# Altium schematic sheet Avcilar_Kartli_Gecis_Sistemi.SchDoc
size A4; SheetNumber: 1; SheetTotal: 1
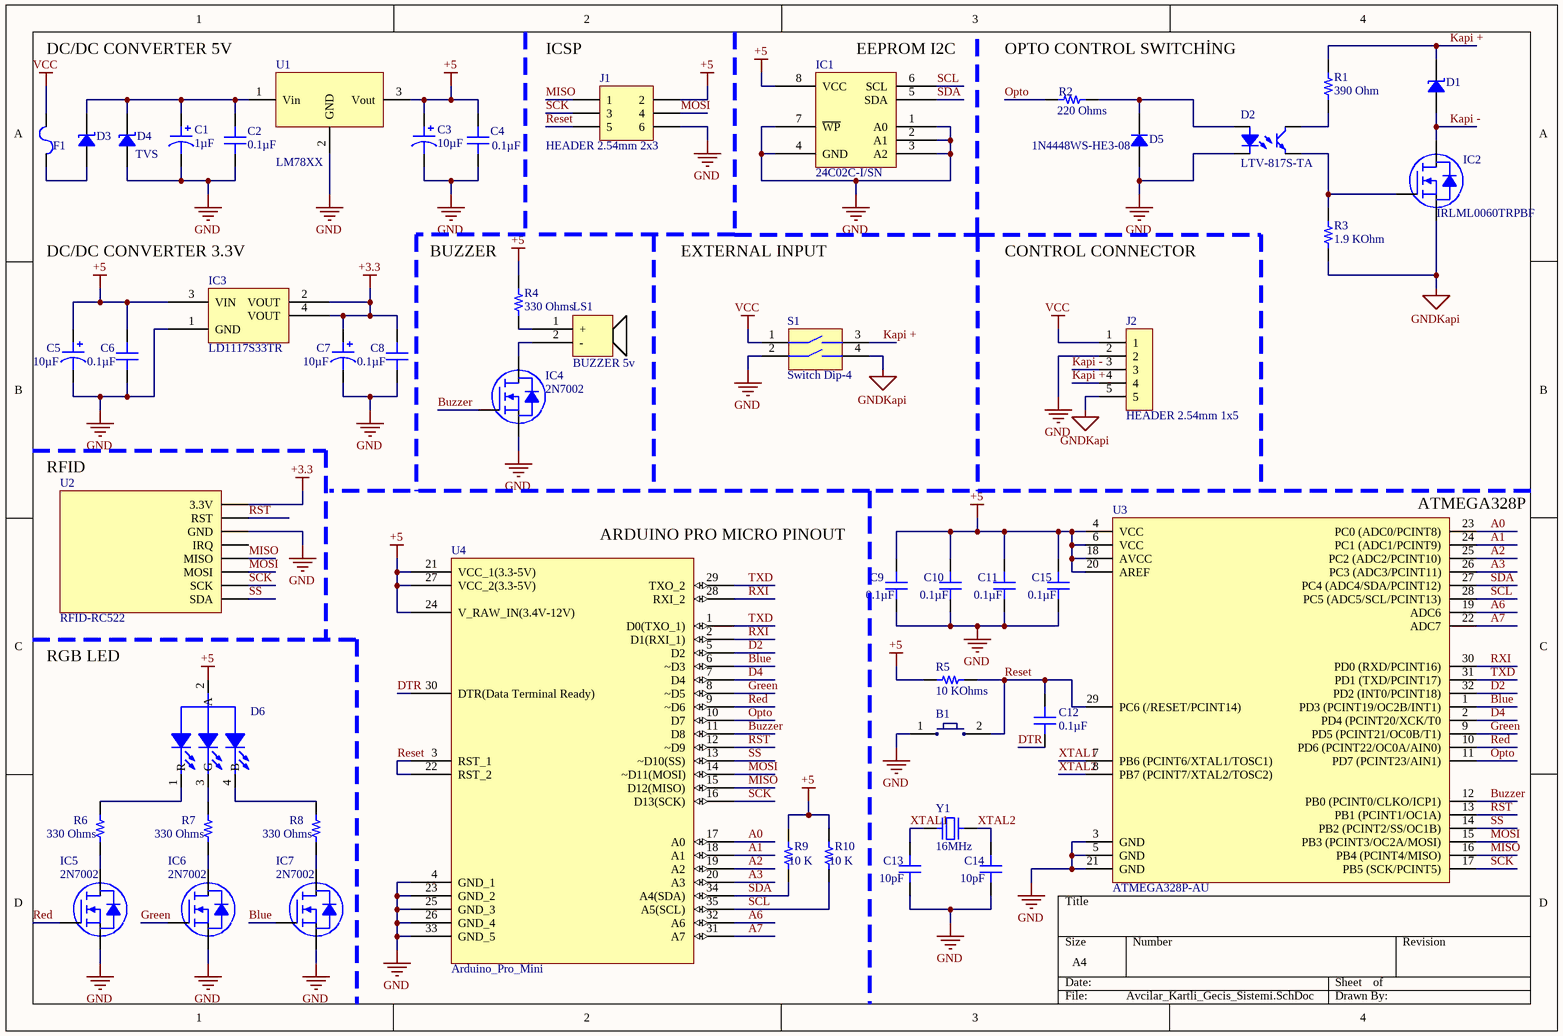
[diagram p0: Avcilar_Kartli_Gecis_Sistemi.SchDoc]

## Parts
B1  Push Button Tact  [PUSB BUTTON-SMD TACT]  (value not drawn)
C1  1µF  [CAP ALSMD POLY 4.3MM H5.5MM]
C2  0.1µF  [CAP 1206_3216 - 1.8MM]
C3  10µF  [CAP POL 1206_3216]
C4  0.1µF  [CAP 1206_3216 - 1.0MM]
C5  10µF  [CAP POL 1206_3216]
C6  0.1µF  [CAP 1206_3216 - 1.0MM]
C7  10µF  [CAP POL 1206_3216]
C8  0.1µF  [CAP 1206_3216 - 1.0MM]
C9  0.1µF  [CAP 1206_3216 - 1.0MM]
C10  0.1µF  [CAP 1206_3216 - 1.0MM]
C11  0.1µF  [CAP 1206_3216 - 1.0MM]
C12  0.1µF  [CAP 1206_3216 - 1.0MM]
C13  10pF  [CAP 1206_3216 - 1.0MM]
C14  10pF  [CAP 1206_3216 - 1.0MM]
C15  0.1µF  [CAP 1206_3216 - 1.0MM]
D1  S2G_R3_00001  [DO214AB SMC]  (value not drawn)
D2  LTV-817S-TA  [DIP-4]
D3  S2G_R3_00001  [DO214AB SMC]  (value not drawn)
D4  TVS  [DO214AC SMA]
D5  1N4448WS-HE3-08  [SOD323]
D6  RGB LED  [RGB LED]  (value not drawn)
F1  3413.0219.22  [FUSE 1206_3216 0.6MM]  (value not drawn)
IC1  24C02C-I/SN  [MICROCHIP SOIC-8 150MIL WIDE]
IC2  IRLML0060TRPBF  [INFINEON SOT-23-3]
IC3  LD1117S33TR  [ST SOT-223]
IC4  2N7002  [ON SEMI SOT-23-3]
IC5  2N7002  [ON SEMI SOT-23-3]
IC6  2N7002  [ON SEMI SOT-23-3]
IC7  2N7002  [ON SEMI SOT-23-3]
J1  HEADER 2.54mm 2x3  [HEADER 2.54mm 2x3]
J2  HEADER 2.54mm 1x5  [HEADER 2.54mm 1x5]
LS1  BUZZER 5v  [BUZZER 5v]
R1  390 Ohm  [RES 1206_3216]
R2  220 Ohms  [RES 1206_3216]
R3  1.9 KOhm  [RES 1206_3216]
R4  330 Ohms  [RES 1206_3216]
R5  10 KOhms  [RES 1206_3216]
R6  330 Ohms  [RES 1206_3216]
R7  330 Ohms  [RES 1206_3216]
R8  330 Ohms  [RES 1206_3216]
R9  10 K  [RES 1206_3216]
R10  10 K  [RES 1206_3216]
S1  Switch Dip-4  [DIP-4 - SWITCH]
U1  LM78XX  [D2PAK-3 (TO263-3)]
U2  RFID-RC522  [RFID-RC522]
U3  ATMEGA328P-AU  [TQFP80P900X900X120-32N]
U4  Arduino_Pro_Mini  [Arduino_Pro_Mini]
Y1  16MHz  [TXC 9C]

## Nets
+3.3: C7.1 C8.2 IC3.2(VOUT) IC3.4(VOUT) U2.1(3.3V)
+5: C3.1 C4.2 C5.1 C6.2 C9.2 C10.2 C11.2 C15.2 D6.2(A) IC1.8(VCC) IC3.3(VIN) J1.2 R4.2 R5.1 R9.1 R10.1 U1.3(Vout) U3.4(VCC) U3.6(VCC) U3.18(AVCC) U3.20(AREF) U4.21(VCC_1(3.3-5V)) U4.24(V_RAW_IN(3.4V-12V)) U4.27(VCC_2(3.3-5V))
GND: B1.1 C1.2 C2.1 C3.2 C4.1 C5.2 C6.1 C7.2 C8.1 C9.1 C10.1 C11.1 C13.1 C14.1 C15.1 D2.2 D4.1 D5.1 IC1.1(A0) IC1.2(A1) IC1.3(A2) IC1.4(GND) IC1.7(~{WP}) IC3.1(GND) IC4.2(S) IC5.2(S) IC6.2(S) IC7.2(S) J1.6 J2.2 S1.2 U1.2(GND) U2.3(GND) U3.3(GND) U3.5(GND) U3.21(GND) U4.4(GND_1) U4.23(GND_2) U4.25(GND_3) U4.26(GND_4) U4.33(GND_5)
GNDKapi: IC2.2(S) J2.5 R3.1 S1.4
VCC: F1.2 J2.1 S1.1
A0: U3.23(PC0_(ADC0/PCINT8)) U4.17(A0)
A1: U3.24(PC1_(ADC1/PCINT9)) U4.18(A1)
A2: U3.25(PC2_(ADC2/PCINT10)) U4.19(A2)
A3: U3.26(PC3_(ADC3/PCINT11)) U4.20(A3)
A6: U3.19(ADC6) U4.32(A6)
A7: U3.22(ADC7) U4.31(A7)
Blue: IC7.1(G) U3.1(PD3_(PCINT19/OC2B/INT1)) U4.6(~D3)
Buzzer: IC4.1(G) U3.12(PB0_(PCINT0/CLKO/ICP1)) U4.11(D8)
D2: U3.32(PD2_(INT0/PCINT18)) U4.5(D2)
D4: U3.2(PD4_(PCINT20/XCK/T0) U4.7(D4)
DTR: C12.1 U4.30(DTR(Data_Terminal_Ready))
Green: IC6.1(G) U3.9(PD5_(PCINT21/OC0B/T1)) U4.8(~D5)
Kapi +: D1.2 J2.4 R1.2 S1.3
Kapi -: D1.1 IC2.3(D) J2.3
MISO: J1.1 U2.5(MISO) U3.16(PB4_(PCINT4/MISO)) U4.15(D12(MISO))
MOSI: J1.4 U2.6(MOSI) U3.15(PB3_(PCINT3/OC2A/MOSI)) U4.14(~D11(MOSI))
Opto: R2.2 U3.11(PD7_(PCINT23/AIN1)) U4.10(D7)
Red: IC5.1(G) U3.10(PD6_(PCINT22/OC0A/AIN0)) U4.9(~D6)
Reset: B1.2 C12.2 J1.5 R5.2 U3.29(PC6_(/RESET/PCINT14)) U4.3(RST_1) U4.22(RST_2)
RST: U2.2(RST) U3.13(PB1_(PCINT1/OC1A)) U4.12(~D9)
RXI: U3.30(PD0_(RXD/PCINT16)) U4.2(D1(RXI_1)) U4.28(RXI_2)
SCK: J1.3 U2.7(SCK) U3.17(PB5_(SCK/PCINT5)) U4.16(D13(SCK))
SCL: IC1.6(SCL) R10.2 U3.28(PC5_(ADC5/SCL/PCINT13)) U4.35(A5(SCL))
SDA: IC1.5(SDA) R9.2 U3.27(PC4_(ADC4/SDA/PCINT12)) U4.34(A4(SDA))
SS: U2.8(SDA) U3.14(PB2_(PCINT2/SS/OC1B)) U4.13(~D10(SS))
TXD: U3.31(PD1_(TXD/PCINT17)) U4.1(D0(TXO_1)) U4.29(TXO_2)
XTAL1: C13.2 U3.7(PB6_(PCINT6/XTAL1/TOSC1)) Y1.1
XTAL2: C14.2 U3.8(PB7_(PCINT7/XTAL2/TOSC2)) Y1.2
NetC1_1: C1.1 C2.2 D3.2 D4.2 U1.1(Vin)
NetD2_1: D2.1 D5.2 R2.1
NetD2_3: D2.3 IC2.1(G) R3.2
NetD2_4: D2.4 R1.1
NetD3_1: D3.1 F1.1
NetD6_1: D6.1(R) R6.2
NetD6_3: D6.3(G) R7.2
NetD6_4: D6.4(B) R8.2
NetIC4_3: IC4.3(D) LS1.2(-)
NetIC5_3: IC5.3(D) R6.1
NetIC6_3: IC6.3(D) R7.1
NetIC7_3: IC7.3(D) R8.1
NetLS1_1: LS1.1(+) R4.1

Not connected (* = marked no-connect by the designer): U2 4(IRQ)

## Notes on the sheet
- DC/DC CONVERTER 5V
- (near J1) ICSP
- (near IC1) EEPROM I2C
- (near R2) OPTO CONTROL SWITCHİNG
- (near IC3) DC/DC CONVERTER 3.3V
- (near R4) BUZZER
- EXTERNAL INPUT
- CONTROL CONNECTOR
- RFID
- (near U3) ATMEGA328P
- (near U4) ARDUINO PRO MICRO PINOUT
- RGB LED

## Library data of the parts
B1 = Push Button Tact: Smd Push Button Tact Mini Tip; Satın Alma Linki: https://urun.n11.com/diger/mini-pushbutton-switch-smd-P227461537?gclid=Cj0KCQjwkoDmBRCcARIsAG3xzl8Y_-jeD7HocNM6lvuZ_rVp83568XPGtNzlPwXWLph8oCRqo0yh87UaApZYEALw_wcB&gclsrc=aw.ds
C1 = 50SEV1M4X5.5: CAP ALUM 1UF 20% 50V SMD; Manufacturer: Rubycon; Lifetime @ Temp.: 2000 Hrs @ 85°C; Polarization: Polar; Ripple Current @ High Frequency: 12.6mA @ 10kHz; Ripple Current @ Low Frequency: 8.4mA @ 120Hz; Surface Mount Land Size: 0.169" L x 0.169" W (4.30mm x 4.30mm); Part Number: 50SEV1M4X5.5; Applications: Automotive; Capacitance: 1µF; ComponentLink1Description: Datasheet; ComponentLink1URL: http://www.rubycon.co.jp/en/catalog/e_pdfs/aluminum/e_sev.pdf; ComponentLink2Description: DigiKey Link; ComponentLink2URL: http://digikey.com/product-detail/en/rubycon/50SEV1M4X5.5/1189-2464-1-ND/4842368; Device Package: Radial, Can - SMD; Height - Seated (Max): 0.217" (5.50mm); LastUpdated: 02/09/2020 01:23:45; Lifecycle Status: Active; Minimum Order: 1; Mounting Type: Surface Mount; Operating Temperature: -40°C ~ 85°C; Package / Case: Radial, Can - SMD; Packaging: TapeAndReel; PartId: 7344; Part Status: Active; Price: 0.10; Ratings: AEC-Q200; Series: SEV; Size / Dimension: 0.157" Dia (4.00mm); Supplier 1: DigiKey; Supplier Part Number 1: 1189-2464-1-ND; Tolerance: ±20%; Value: 1µF; Voltage - Rated: 50V
C2 = CC1206JKNPO9BN104: CAP CER 0.1UF 50V C0G/NP0 1206; Manufacturer: Yageo; Temperature Coefficient: C0G, NP0; Tolerance: ±5%; Part Number: CC1206JKNPO9BN104; Value: 0.1µF; Applications: General Purpose; Capacitance: 0.1µF; ComponentLink1Description: Datasheet; ComponentLink1URL: https://www.yageo.com/upload/media/product/productsearch/datasheet/mlcc/UPY-GP_NP0_16V-to-50V_17.pdf; ComponentLink2Description: DigiKey Link; ComponentLink2URL: http://digikey.com/product-detail/en/yageo/CC1206JKNPO9BN104/311-4621-1-ND/9645659; Device Package: 1206 (3216 Metric); LastUpdated: 02/09/2020 01:05:25; Lifecycle Status: Active; Minimum Order: 1; Mounting Type: Surface Mount, MLCC; Operating Temperature: -55°C ~ 125°C; Package / Case: 1206 (3216 Metric); Packaging: TapeAndReel; PartId: 22519; Part Status: Active; Price: 0.64; Series: CC; Size / Dimension: 0.126" L x 0.063" W (3.20mm x 1.60mm); Supplier 1: DigiKey; Supplier Part Number 1: 311-4621-1-ND; Thickness (Max): 0.071" (1.80mm); Voltage - Rated: 50V
C3 C5 C7 = 293D106X9016A2TE3: CAP TANT 10UF 10% 16V 1206 A Case; Manufacturer: Vishay Sprague; ESR (Equivalent Series Resistance): 3Ohm; Type: Molded; Part Number: 293D106X9016A2TE3; Value: 10µF; Capacitance: 10µF; ComponentLink1Description: Datasheet; ComponentLink1URL: http://www.vishay.com/docs/40002/293d.pdf; ComponentLink2Description: DigiKey Link; ComponentLink2URL: http://digikey.com/product-detail/en/vishay-sprague/293D106X9016A2TE3/718-1123-1-ND/1559617; Device Package: 1206 (3216 Metric); Features: General Purpose; Height - Seated (Max): 0.071" (1.80mm); LastUpdated: 02/09/2020 01:15:58; Lifecycle Status: Active; Manufacturer Size Code: A; Minimum Order: 1; Mounting Type: Surface Mount; Operating Temperature: -55°C ~ 125°C; Package / Case: 1206 (3216 Metric); Packaging: TapeAndReel; PartId: 347; Part Status: Active; Price: 0.13; Series: TANTAMOUNT®, 293D; Size / Dimension: 0.126" L x 0.063" W (3.20mm x 1.60mm); Supplier 1: DigiKey; Supplier Part Number 1: 718-1123-1-ND; Tolerance: ±10%; Voltage - Rated: 16V
C4 C6 C8-C12 C15 = C1206C104K4RACTU: CAP CER 0.1UF 16V X7R 1206; Manufacturer: KEMET; Tolerance: ±10%; Part Number: C1206C104K4RACTU; Value: 0.1µF; Applications: Bypass, Decoupling; Capacitance: 0.1µF; ComponentLink1Description: Datasheet; ComponentLink1URL: https://api.kemet.com/component-edge/download/datasheet/C1206C104K4RACTU.pdf; ComponentLink2Description: DigiKey Link; ComponentLink2URL: http://digikey.com/product-detail/en/kemet/C1206C104K4RACTU/399-9305-1-ND/3522823; Device Package: 1206 (3216 Metric); LastUpdated: 02/09/2020 01:05:06; Lifecycle Status: Active; Minimum Order: 1; Mounting Type: Surface Mount, MLCC; Operating Temperature: -55°C ~ 125°C; Package / Case: 1206 (3216 Metric); Packaging: TapeAndReel; PartId: 19049; Part Status: Active; Price: 0.02; Series: SMD Comm X7R; Size / Dimension: 0.126" L x 0.063" W (3.20mm x 1.60mm); Supplier 1: DigiKey; Supplier Part Number 1: 399-9305-1-ND; Temperature Coefficient: X7R; Thickness (Max): 0.035" (0.88mm); Voltage - Rated: 16V
C13 C14 = C1206C104K4RACTU: CAP CER 0.1UF 16V X7R 1206; Manufacturer: KEMET; Capacitance: 0.1µF; Tolerance: ±10%; Part Number: C1206C104K4RACTU; Value: 10pF; Applications: Bypass, Decoupling; ComponentLink1Description: Datasheet; ComponentLink1URL: https://api.kemet.com/component-edge/download/datasheet/C1206C104K4RACTU.pdf; ComponentLink2Description: DigiKey Link; ComponentLink2URL: http://digikey.com/product-detail/en/kemet/C1206C104K4RACTU/399-9305-1-ND/3522823; Device Package: 1206 (3216 Metric); LastUpdated: 02/09/2020 01:05:06; Lifecycle Status: Active; Minimum Order: 1; Mounting Type: Surface Mount, MLCC; Operating Temperature: -55°C ~ 125°C; Package / Case: 1206 (3216 Metric); Packaging: TapeAndReel; PartId: 19049; Part Status: Active; Price: 0.02; Series: SMD Comm X7R; Size / Dimension: 0.126" L x 0.063" W (3.20mm x 1.60mm); Supplier 1: DigiKey; Supplier Part Number 1: 399-9305-1-ND; Temperature Coefficient: X7R; Thickness (Max): 0.035" (0.88mm); Voltage - Rated: 16V
D1 D3 = SMCJ33A-TR: ER3J-HT SMD 3A 600V Diyot; Manufacturer: STMicroelectronics; Type: Diode; Part Number: S2G_R3_00001; Applications: General Purpose; ComponentLink1Description: Datasheet; ComponentLink1URL: http://www.st.com/content/ccc/resource/technical/document/datasheet/ed/51/0b/1f/07/5e/42/1e/CD00001367.pdf/files/CD00001367.pdf/jcr:content/translations/en.CD00001367.pdf; ComponentLink2Description: DigiKey Link; ComponentLink2URL: http://digikey.com/product-detail/en/stmicroelectronics/SMCJ33A-TR/497-6520-1-ND/1865331; Current - Peak Pulse (10/1000µs): 3A; Lifecycle Status: Active; Minimum Order: 1; Mounting Type: Surface Mount; Operating Temperature: -55°C ~ 150°C (TJ); Package / Case: DO-214AB, SMC; Packaging: TapeAndReel; Series: SMCJ, TRANSIL™; Supplier 1: DigiKey; Supplier Device Package: SMC; ComponentLink3Description: New link; ComponentLink3URL: https://www.direnc.net/er3j-ht-smd-3a-600v-diyot
D2 = LTV-817S-TA: OPTOISOLATR 5KV TRANSISTOR 4-SMD; Manufacturer: Lite-On Inc.; Current - DC Forward (If) (Max): 50mA; Current Transfer Ratio (Max): 600% @ 5mA; Current Transfer Ratio (Min): 50% @ 5mA; Input Type: DC; Number of Channels: 1; Rise / Fall Time (Typ): 4µs, 3µs; Vce Saturation (Max): 200mV; Voltage - Forward (Vf) (Typ): 1.2V; Voltage - Isolation: 5000Vrms; Voltage - Output (Max): 35V; Part Number: LTV-817S-TA; ComponentLink1Description: Datasheet; ComponentLink1URL: http://optoelectronics.liteon.com/upload/download/DS-70-96-0016/LTV-8X7%20series%20201610%20.pdf; ComponentLink2Description: DigiKey Link; ComponentLink2URL: http://digikey.com/product-detail/en/lite-on-inc/LTV-817S-TA/160-2038-1-ND/3711420; Current - Output / Channel: 50mA; Device Package: 4-SMD, Gull Wing; LastUpdated: 12/01/2020 21:59:02; Lifecycle Status: Active; Minimum Order: 1; Mounting Type: Surface Mount; Operating Temperature: -30°C ~ 110°C; Output Type: Transistor; Package / Case: 4-SMD, Gull Wing; Packaging: TapeAndReel; Part Status: Active; Price: 0.12; Series: -; Supplier 1: DigiKey; Supplier Part Number 1: 160-2038-1-ND; Supplier Device Package: 4-SMD
D4 = SMA6J28AHR3G: TVS DIODE 28V 44V DO214AC; Manufacturer: Taiwan Semiconductor Corporation; Current - Peak Pulse (10/1000µs): 13.6A; Power Line Protection: No; Power - Peak Pulse: 600W; Type: Zener; Unidirectional Channels: 1; Voltage - Breakdown (Min): 31.1V; Part Number: SMA6J28AHR3G; Applications: Automotive; ComponentLink1Description: Datasheet; ComponentLink1URL: https://www.taiwansemi.com/products/datasheet/SMA6J%20SERIES_D15.pdf; ComponentLink2Description: DigiKey Link; ComponentLink2URL: http://digikey.com/product-detail/en/taiwan-semiconductor-corporation/SMA6J28AHR3G/SMA6J28AHR3GCT-ND/7358772; LastUpdated: 02/09/2020 01:20:15; Lifecycle Status: Active; Minimum Order: 1; Mounting Type: Surface Mount; Operating Temperature: -55°C ~ 175°C (TJ); Package / Case: DO-214AC, SMA; Packaging: TapeAndReel; PartId: 5851; Part Status: Active; Price: 0.13; Series: Automotive, AEC-Q101, SMA6J; Supplier 1: DigiKey; Supplier Part Number 1: SMA6J28AHR3GCT-ND; Supplier Device Package: DO-214AC (SMA); Voltage - Clamping (Max) @ Ipp: 44V; Voltage - Reverse Standoff (Typ): 28V
D5 = 1N4448WS-HE3-08: DIODE GEN PURP 75V 150MA SOD323; Manufacturer: Vishay Semiconductor Diodes Division; Current - Reverse Leakage @ Vr: 5µA @ 75V; Diode Type: Standard; Reverse Recovery Time (trr): 4ns; Speed: Small Signal =< 200mA (Io), Any Speed; Voltage - Forward (Vf) (Max) @ If: 720mV @ 5mA; Part Number: 1N4448WS-HE3-08; ComponentLink1Description: Datasheet; ComponentLink1URL: http://www.vishay.com/docs/81387/1n4448ws.pdf; ComponentLink2Description: DigiKey Link; ComponentLink2URL: http://digikey.com/product-detail/en/vishay-semiconductor-diodes-division/1N4448WS-HE3-08/1N4448WS-HE3-08GICT-ND/8564630; Current - Average Rectified (Io): 150mA; LastUpdated: 02/09/2020 01:27:24; Lifecycle Status: Active; Minimum Order: 1; Mounting Type: Surface Mount; Operating Temperature - Junction: -55°C ~ 150°C; Package / Case: SC-76, SOD-323; Packaging: TapeAndReel; PartId: 2873; Part Status: Active; Price: 0.05; Series: -; Supplier 1: DigiKey; Supplier Part Number 1: 1N4448WS-HE3-08GICT-ND; Supplier Device Package: SOD-323; Voltage - DC Reverse (Vr) (Max): 75V
D6 = RGB LED: RGB LED Common Anode; Manufacturer Code: LGN971; Manufacturer: OSRAM; Value: Green; Farnell Code: 1226371; Unit Price: 0,127 €
F1 = 3413.0219.22: PTC Fuse FUSE BRD MNT 2A 32VAC 63VDC 1206 PTC Fuse; Manufacturer: Schurter Inc.; Approval Agency: cURus, VDE; Breaking Capacity @ Rated Voltage: 63A; Fuse Type: Board Mount (Cartridge Style Excluded); Melting I²t: 0.79; Response Time: Fast Blow; Voltage Rating - AC: 32V; Voltage Rating - DC: 63V; Part Number: 3413.0219.22; Approvals: cURus, VDE; ComponentLink1Description: Datasheet; ComponentLink1URL: https://us.schurter.com/pdf/english/typ_USI_1206.pdf; ComponentLink2Description: DigiKey Link; ComponentLink2URL: http://digikey.com/product-detail/en/schurter-inc/3413.0219.22/486-1147-1-ND/1522979; Current Rating (Amps): 2A; Device Package: 1206 (3216 Metric); LastUpdated: 02/09/2020 01:30:41; Lifecycle Status: Active; Minimum Order: 1; Mounting Type: Surface Mount; Operating Temperature: -55°C ~ 90°C; Package / Case: 1206 (3216 Metric); Packaging: TapeAndReel; Part Status: Active; Price: 0.26; Series: USI 1206; Size / Dimension: 0.126" L x 0.063" W x 0.024" H (3.20mm x 1.60mm x 0.60mm); Supplier 1: DigiKey; Supplier Part Number 1: 486-1147-1-ND; ComponentLink3Description: New link; ComponentLink3URL: https://www.turus.com.tr/kategori/smd-sigorta
IC1 = 24C02C-I/SN: IC EEPROM 2K I2C 400KHZ 8SOIC; Manufacturer: Microchip Technology; Access Time: 900ns; Memory Interface: I²C; Memory Size: 2Kb (256 x 8); Memory Type: Non-Volatile; Voltage - Supply: 4.5V ~ 5.5V; Write Cycle Time - Word, Page: 1ms; Part Number: 24C02C-I/SN; Clock Frequency: 400kHz; ComponentLink1Description: Datasheet; ComponentLink1URL: http://www.microchip.com/mymicrochip/filehandler.aspx?ddocname=en011859; ComponentLink2Description: DigiKey Link; ComponentLink2URL: http://digikey.com/product-detail/en/microchip-technology/24C02C-I-SN/24C02C-I-SN-ND/318617; LastUpdated: 02/09/2020 01:23:02; Lifecycle Status: Active; Memory Format: EEPROM; Minimum Order: 1; Mounting Type: Surface Mount; Operating Temperature: -40°C ~ 85°C (TA); Package / Case: 8-SOIC (0.154", 3.90mm Width); Packaging: Tube; PartId: 1028; Part Status: Active; Price: 0.26; Series: -; Supplier 1: DigiKey; Supplier Part Number 1: 24C02C-I/SN-ND; Supplier Device Package: 8-SOIC; Technology: EEPROM
IC2 = IRLML0060TRPBF: MOSFET N-CH 60V 2.7A SOT-23-3; Manufacturer: Infineon Technologies; Current - Continuous Drain (Id) @ 25°C: 2.7A (Ta); Drive Voltage (Max Rds On,  Min Rds On): 4.5V, 10V; FET Type: N-Channel; Gate Charge (Qg) (Max) @ Vgs: 2.5nC @ 4.5V; Input Capacitance (Ciss) (Max) @ Vds: 290pF @ 25V; Power Dissipation (Max): 1.25W (Ta); Rds On (Max) @ Id, Vgs: 92mOhm @ 2.7A, 10V; Vgs (Max): ±16V; Vgs(th) (Max) @ Id: 2.5V @ 25µA; Part Number: IRLML0060TRPBF; ComponentLink1Description: Datasheet; ComponentLink1URL: https://www.infineon.com/dgdl/irlml0060pbf.pdf?fileId=5546d462533600a40153566493ef25e6; ComponentLink2Description: DigiKey Link; ComponentLink2URL: http://digikey.com/product-detail/en/infineon-technologies/IRLML0060TRPBF/IRLML0060TRPBFCT-ND/2202229; Drain to Source Voltage (Vdss): 60V; LastUpdated: 02/09/2020 01:25:05; Lifecycle Status: Active; Minimum Order: 1; Mounting Type: Surface Mount; Operating Temperature: -55°C ~ 150°C (TJ); Package / Case: TO-236-3, SC-59, SOT-23-3; Packaging: TapeAndReel; Part Status: Active; Price: 0.13; Series: HEXFET®; Supplier 1: DigiKey; Supplier Part Number 1: IRLML0060TRPBFCT-ND; Supplier Device Package: Micro3™/SOT-23; Technology: MOSFET (Metal Oxide)
IC3 = LD1117S33TR: IC REG LINEAR 3.3V 800MA SOT223; Manufacturer: STMicroelectronics; Current - Quiescent (Iq): 10mA; Number of Regulators: 1; Output Configuration: Positive; Output Type: Fixed; Protection Features: Over Current, Over Temperature; PSRR: 75dB (120Hz); Voltage Dropout (Max): 1.2V @ 800mA; Voltage - Input (Max): 15V; Part Number: LD1117S33TR; ComponentLink1Description: Datasheet; ComponentLink1URL: http://www.st.com/content/ccc/resource/technical/document/datasheet/99/3b/7d/91/91/51/4b/be/CD00000544.pdf/files/CD00000544.pdf/jcr:content/translations/en.CD00000544.pdf; ComponentLink2Description: DigiKey Link; ComponentLink2URL: http://digikey.com/product-detail/en/stmicroelectronics/LD1117S33TR/497-1242-1-ND/586242; Current - Output: 800mA; LastUpdated: 02/09/2020 01:24:39; Lifecycle Status: Active; Minimum Order: 1; Mounting Type: Surface Mount; Package / Case: TO-261-4, TO-261AA; Packaging: TapeAndReel; Part Status: Active; Price: 0.14; Series: -; Supplier 1: DigiKey; Supplier Part Number 1: 497-1242-1-ND; Supplier Device Package: SOT-223; Voltage - Output (Min/Fixed): 3.3V
IC4-IC7 = 2N7002: MOSFET N-CH 60V 115MA SOT-23; Manufacturer: ON Semiconductor; Current - Continuous Drain (Id) @ 25°C: 115mA (Ta); Drive Voltage (Max Rds On,  Min Rds On): 5V, 10V; FET Type: N-Channel; Input Capacitance (Ciss) (Max) @ Vds: 50pF @ 25V; Power Dissipation (Max): 200mW (Ta); Rds On (Max) @ Id, Vgs: 7.5Ohm @ 500mA, 10V; Vgs (Max): ±20V; Vgs(th) (Max) @ Id: 2.5V @ 250µA; Part Number: 2N7002; ComponentLink1Description: Datasheet; ComponentLink1URL: https://www.onsemi.com/pub/Collateral/NDS7002A-D.PDF; ComponentLink2Description: DigiKey Link; ComponentLink2URL: http://digikey.com/product-detail/en/on-semiconductor/2N7002/2N7002NCT-ND/244664; Drain to Source Voltage (Vdss): 60V; LastUpdated: 02/09/2020 01:25:08; Lifecycle Status: Active; Minimum Order: 1; Mounting Type: Surface Mount; Operating Temperature: -55°C ~ 150°C (TJ); Package / Case: TO-236-3, SC-59, SOT-23-3; Packaging: TapeAndReel; Part Status: Active; Price: 0.06; Series: -; Supplier 1: DigiKey; Supplier Part Number 1: 2N7002NCT-ND; Supplier Device Package: SOT-23 (TO-236AB); Technology: MOSFET (Metal Oxide)
LS1 = BUZZER 5v: BUZZER 5v YX-YT12075-YT05D; ComponentLink1Description: New link; ComponentLink1URL: https://ozdisan.com/elektromekanik-komponentler/ses-urunleri/buzzerlar/YX-YT12075-YT05D
R1-R8 = SR1206FR-7W330RL: RES SMD 1206 1/2W 1% 330 OHM; Manufacturer: Yageo; Power (Watts): 0.5W, 1/2W; Temperature Coefficient: ±200ppm/°C; Part Number: SR1206FR-7W330RL; ComponentLink1Description: Datasheet; ComponentLink1URL: http://www.yageo.com/documents/recent/PYu-SR_D_F%20tol_RoHS_L_4.pdf; ComponentLink2Description: DigiKey Link; ComponentLink2URL: http://digikey.com/product-detail/en/yageo/SR1206FR-7W330RL/YAG5901CT-ND/9373286; Composition: Thick Film; Device Package: 1206 (3216 Metric); Features: Automotive AEC-Q200, Pulse Withstanding; Height - Seated (Max): 0.026" (0.65mm); LastUpdated: 02/09/2020 01:12:27; Lifecycle Status: Active; Minimum Order: 1; Number of Terminations: 2; Operating Temperature: -55°C ~ 155°C; Package / Case: 1206 (3216 Metric); Packaging: TapeAndReel; PartId: 45016; Part Status: Active; Price: 0.18; Ratings: AEC-Q200; Series: SR; Size / Dimension: 0.122" L x 0.063" W (3.10mm x 1.60mm); Supplier 1: DigiKey; Supplier Part Number 1: YAG5901CT-ND; Supplier Device Package: 1206; Tolerance: ±1%
  R1: Resistance: 390 Ohm; Value: 390 Ohm
  R2: Resistance: 220 Ohms; Value: 220 Ohms
  R3: Resistance: 1.9 KOhm; Value: 1.9 KOhm
  R4 R6-R8: Resistance: 330 Ohms; Value: 330 Ohms
  R5: Resistance: 10 KOhms; Value: 10 KOhms
R9 R10 = SR1206FR-7W330RL: RES SMD 1206 1/2W 1% 330 OHM; Manufacturer: Yageo; Power (Watts): 0.5W, 1/2W; Resistance: 10 KOhms; Temperature Coefficient: ±200ppm/°C; Part Number: SR1206FR-7W330RL; ComponentLink1Description: Datasheet; ComponentLink1URL: http://www.yageo.com/documents/recent/PYu-SR_D_F%20tol_RoHS_L_4.pdf; ComponentLink2Description: DigiKey Link; ComponentLink2URL: http://digikey.com/product-detail/en/yageo/SR1206FR-7W330RL/YAG5901CT-ND/9373286; Composition: Thick Film; Device Package: 1206 (3216 Metric); Features: Automotive AEC-Q200, Pulse Withstanding; Height - Seated (Max): 0.026" (0.65mm); LastUpdated: 02/09/2020 01:12:27; Lifecycle Status: Active; Minimum Order: 1; Number of Terminations: 2; Operating Temperature: -55°C ~ 155°C; Package / Case: 1206 (3216 Metric); Packaging: TapeAndReel; PartId: 45016; Part Status: Active; Price: 0.18; Ratings: AEC-Q200; Series: SR; Size / Dimension: 0.122" L x 0.063" W (3.10mm x 1.60mm); Supplier 1: DigiKey; Supplier Part Number 1: YAG5901CT-ND; Supplier Device Package: 1206; Tolerance: ±1%; Value: 10 K
U1 = LM78XX: 7805 SMD D2pak Regülatör - L7805CD2T; ComponentLink1Description: New link; ComponentLink1URL: https://www.direnc.net/7805-d2pak--regulator
U2 = RFID-RC522: RFID-RC522 Card Reader Module
U3 = ATMEGA328P-AU: IC-328 MCU 8BIT 32KB FLASH 32TQPF ATMEL; ComponentLink1Description: New link; ComponentLink1URL: https://www.direnc.net/atmega328p-au-smd-8bit-20mhz-mikrodenetleyici-tqfp32
U4 = Arduino_Pro_Mini: Microcontroller: ATmega328 / Operating Voltage: 5V / Input Voltage: 5 – 12 V (5V model) / Digital I/O Pins: 14 Pins (6 are PWM output pins) / Analog Input Pins: 6 Pins / DC Current per I/O Pin: 40 mA / Flash Memory: 32 kB (0.5 kB is taken by bootloader) / SRAM: 2 Kbytes / EEPROM: 1 Kbytes / Clock Speed: 16 MHz (5V model); Arduino_Pro_Mini: Arduino_Pro_Mini
Y1 = 9C-16.000MAAJ-T: CRYSTAL 16.0000MHZ 18PF SMD; Manufacturer: TXC CORPORATION; ESR (Equivalent Series Resistance): 30 Ohms; Frequency Stability: ±30ppm; Operating Mode: Fundamental; Part Number: 9C-16.000MAAJ-T; ComponentLink1Description: Datasheet; ComponentLink1URL: http://www.txccorp.com/download/products/quartz_crystals/2015TXC_9C_32.pdf; ComponentLink2Description: DigiKey Link; ComponentLink2URL: http://digikey.com/product-detail/en/txc-corporation/9C-16.000MAAJ-T/887-1059-1-ND/2118936; Frequency: 16MHz; Frequency Tolerance: ±30ppm; Height - Seated (Max): 0.161" (4.10mm); LastUpdated: 02/09/2020 01:22:01; Lifecycle Status: Active; Load Capacitance: 18pF; Minimum Order: 1; Mounting Type: Surface Mount; Operating Temperature: -20°C ~ 70°C; Package / Case: HC-49/US; Packaging: TapeAndReel; PartId: 708; Part Status: Active; Price: 0.22; Series: 9C; Size / Dimension: 0.449" L x 0.189" W (11.40mm x 4.80mm); Supplier 1: DigiKey; Supplier Part Number 1: 887-1059-1-ND; Type: MHz Crystal; Value: 16MHz